# Altium project RNG_RPI.PrjPcb (part 1 of 3)
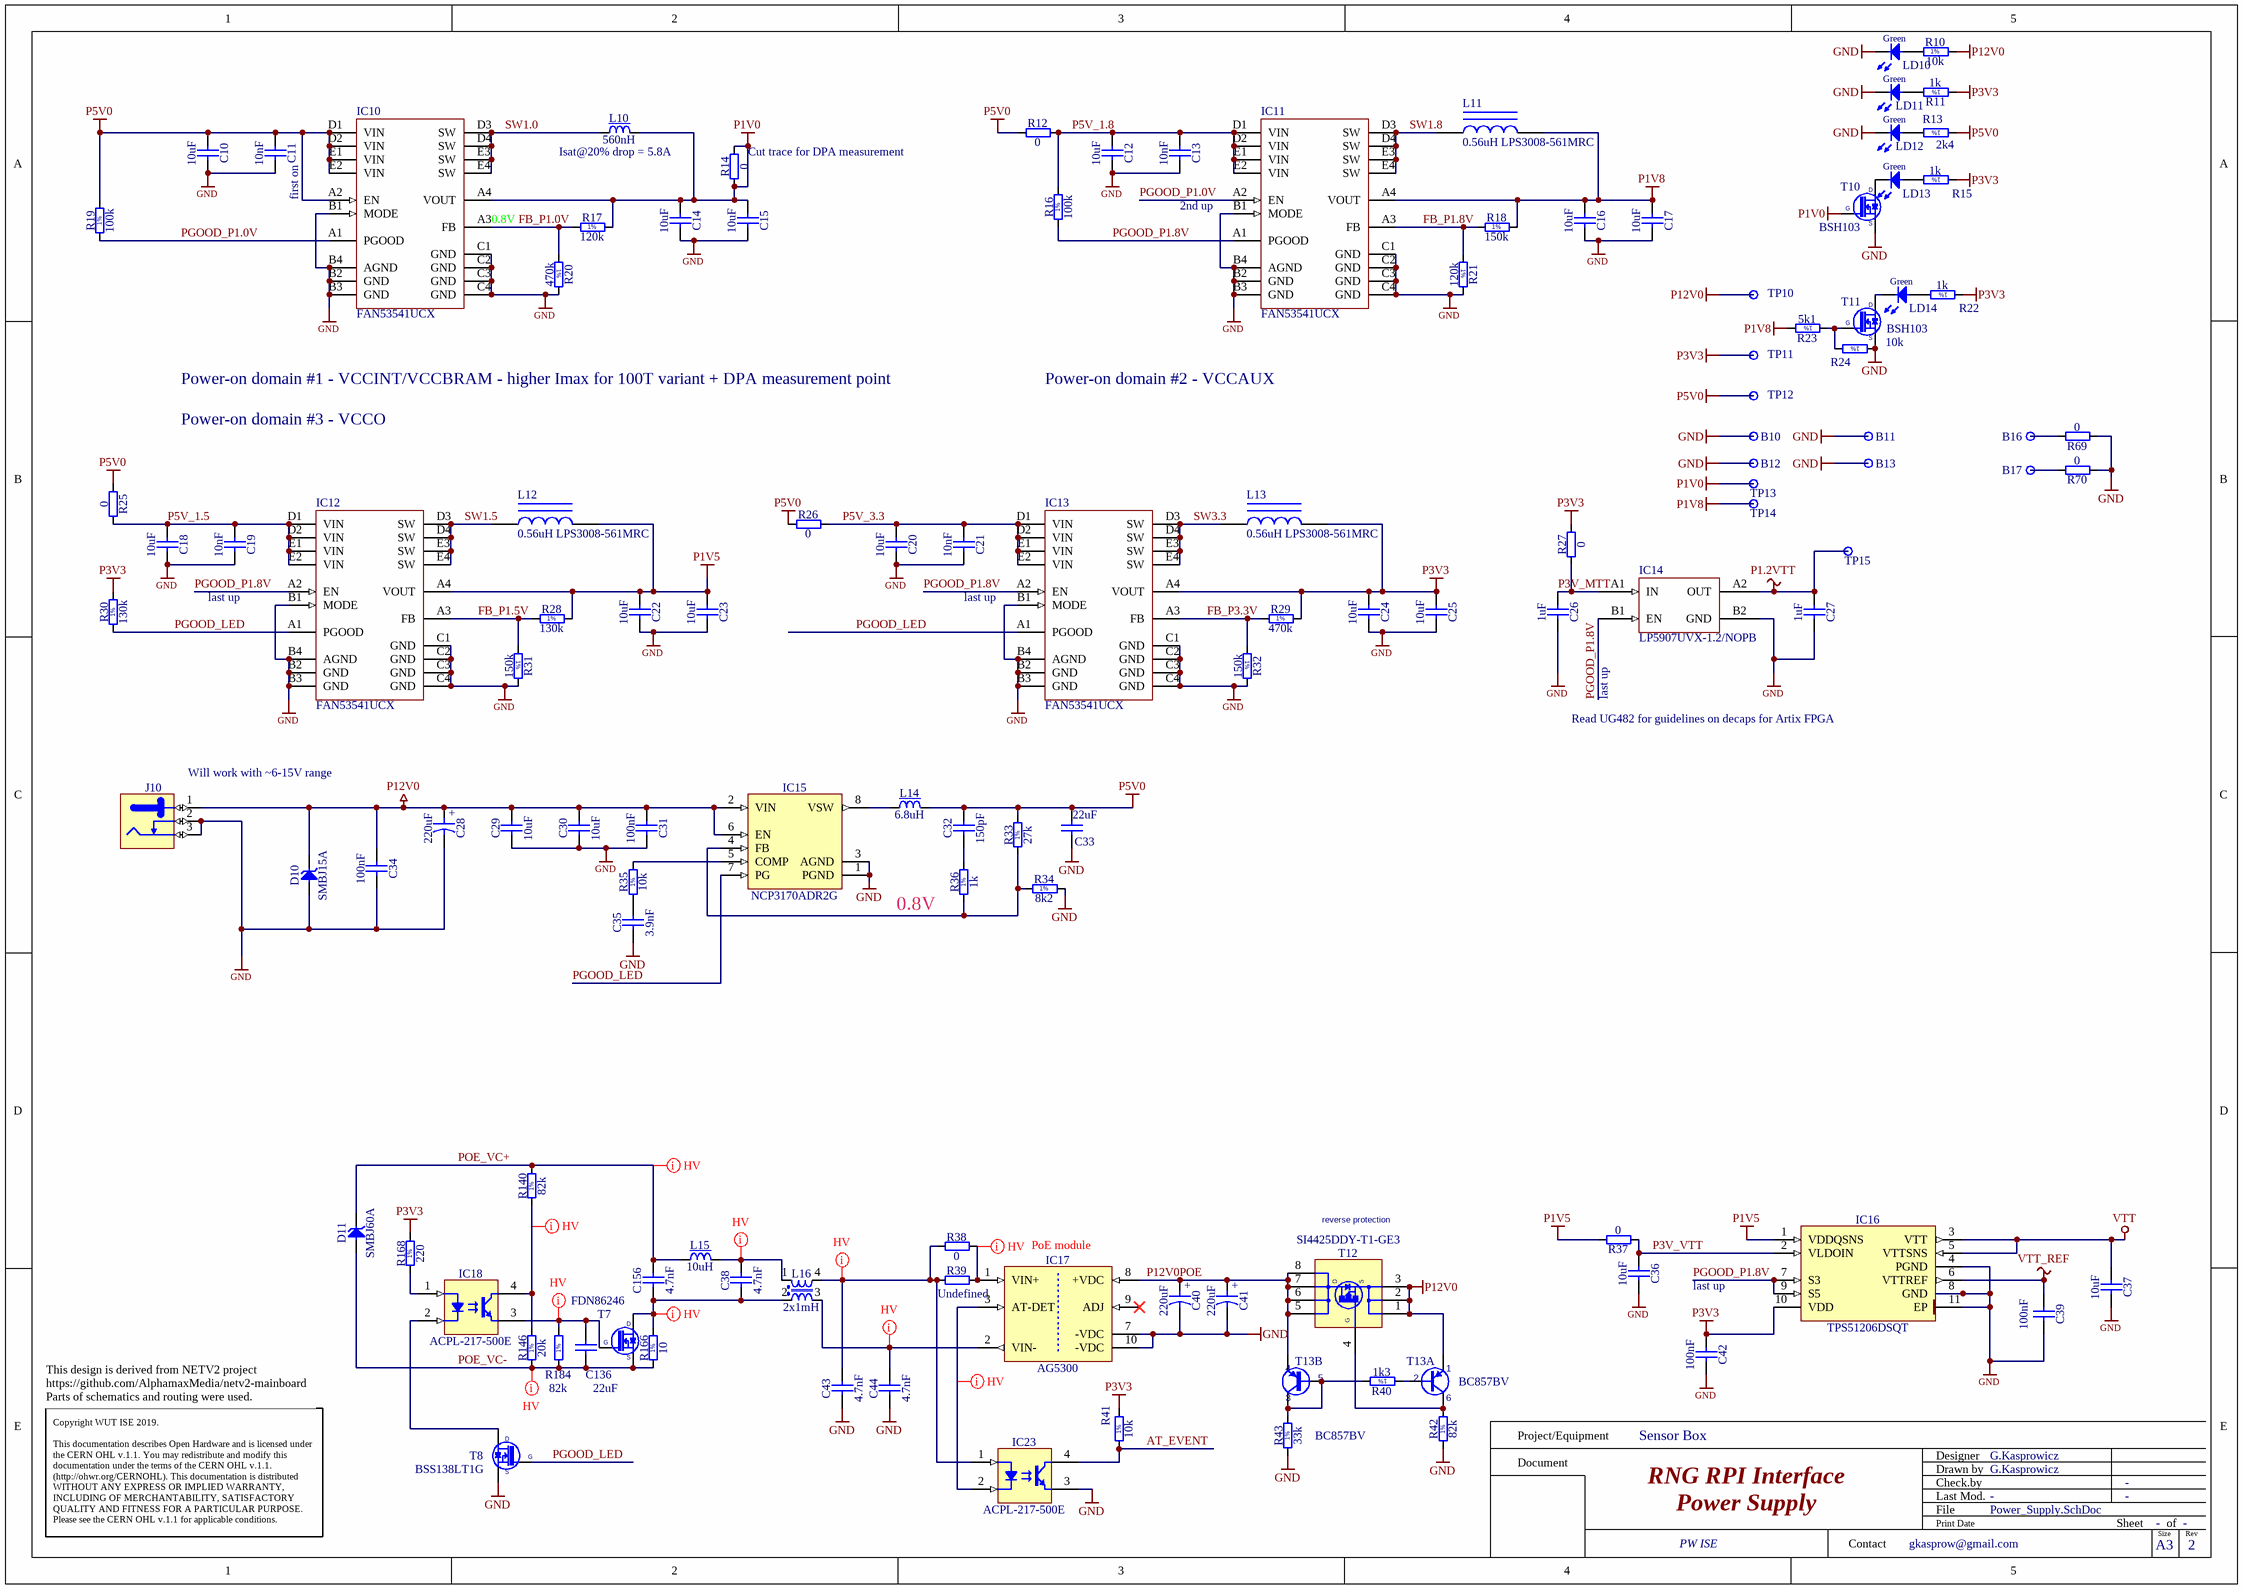
[diagram p0: Power_Supply.SchDoc]
7 sheets, 368 parts. Net scope: global (net labels, ports and power ports of the same name join across sheets).
Board file: RNG_RPI.PCBDOC
Sheets:
  Power_Supply.SchDoc
  FPGA_config.SchDoc
  FPGA.SchDoc
  DDR3_Memory.SchDoc
  GPS_SATA.SchDoc
  Ethernet_SD.SchDoc
  FPGA_Supply.SchDoc

## Sheet Power_Supply.SchDoc: RNG RPI Interface
size 420 x 297 mm; Author: G.Kasprowicz; CompanyName: WUT ISE; DrawnBy: G.Kasprowicz; Organization: WUT ISE; Address1: PW ISE; Address2: Nowowiejska 15/19 00-665 Warsaw; Address3: gkasprow@gmail.com; Revision: 2; SheetNumber: -; SheetTotal: -; ModifiedBy: -; CheckedDate: -; Title2: Power Supply; DivGrp: WUT ISE; Designer: G.Kasprowicz; ModifiedDate: -; ProjectName: Sensor Box

### Parts
B10  Plated Hole  [c130h60]  (value not drawn)  (no BOM)
B11  Plated Hole  [c130h60]  (value not drawn)  (no BOM)
B12  Plated Hole  [c130h60]  (value not drawn)  (no BOM)
B13  Plated Hole  [c130h60]  (value not drawn)  (no BOM)
B16  Plated Hole  [MTG270_500]  (value not drawn)  (no BOM)
B17  Plated Hole  [MTG270_500]  (value not drawn)  (no BOM)
C10  10uF  [CAPC1608X80N]
C11  10nF  [CAPC1005X55N]
C12  10uF  [CAPC1608X80N]
C13  10nF  [CAPC1005X55N]
C14  10uF  [CAPC1608X80N]
C15  10uF  [CAPC1608X80N]
C16  10uF  [CAPC1608X80N]
C17  10uF  [CAPC1608X80N]
C18  10uF  [CAPC1608X80N]
C19  10nF  [CAPC1005X55N]
C20  10uF  [CAPC1608X80N]
C21  10nF  [CAPC1005X55N]
C22  10uF  [CAPC1608X80N]
C23  10uF  [CAPC1608X80N]
C24  10uF  [CAPC1608X80N]
C25  10uF  [CAPC1608X80N]
C26  1uF  [CAPC1005X55N]
C27  1uF  [CAPC1005X55N]
C28  220uF  [CAPAE830X620N]
C29  10uF  [CAPC3216X180N]
C30  10uF  [CAPC3216X180N]
C31  100nF  [CAPC2012X135N]
C32  150pF  [CAPC1608X87N]
C33  22uF  [CAPC2012X135N]
C34  100nF  [CAPC2012X135N]
C35  3.9nF  [CAPC1608X87N]
C36  10uF  [CAPC1608X80N]
C37  10uF  [CAPC1608X80N]
C38  4.7nF  [CAPC3216X140N]
C39  100nF  [CAPC0603X33N]
C40  220uF  [CAPAE830X620N]
C41  220uF  [CAPAE830X620N]
C42  100nF  [CAPC0603X33N]
C43  4.7nF  [CAPC3216X140N]
C44  4.7nF  [CAPC3216X140N]
C136  22uF  [CAPC2012X135N]
C156  4.7nF  [CAPC3216X140N]
D10  SMBJ15A  [DIOM5336X265N]
D11  SMBJ60A  [DIOM5336X265N]
IC10  FAN53541UCX  [BGA20C40P4X5_156X196X62]
IC11  FAN53541UCX  [BGA20C40P4X5_156X196X62]
IC12  FAN53541UCX  [BGA20C40P4X5_156X196X62]
IC13  FAN53541UCX  [BGA20C40P4X5_156X196X62]
IC14  LP5907UVX-1.2/NOPB  [TI_YKE004]
IC15  NCP3170ADR2G  [SOIC127P600X175-8N]
IC16  TPS51206DSQT  [SON40P200X200X80-11N-R100X160]
IC17  AG5300  [SILVERTEL_AG5300]
IC18  ACPL-217-500E  [SOIC127P700X242-4N]
IC23  ACPL-217-500E  [SOIC127P700X242-4N]
J10  Jack  [CLIFF_FC68148(DC-10A)]  (value not drawn)
L10  560nH  [IND_COILCRAFT_XAL5020]
L11  0.56uH LPS3008-561MRC  [COILCRAFT_LPS3008]
L12  0.56uH LPS3008-561MRC  [COILCRAFT_LPS3008]
L13  0.56uH LPS3008-561MRC  [COILCRAFT_LPS3008]
L14  6.8uH  [INDM6965X300N]
L15  10uH  [IND_MURATA-PS_8400]
L16  2x1mH  [IND_WURTH_WE-SL2]
LD10  Green  [LED_KINGBRIGHT_KPH-1608CGCK]
LD11  Green  [LED_KINGBRIGHT_KPH-1608CGCK]
LD12  Green  [LED_KINGBRIGHT_KPH-1608CGCK]
LD13  Green  [LED_KINGBRIGHT_KPH-1608CGCK]
LD14  Green  [LED_KINGBRIGHT_KPH-1608CGCK]
R10  10k  [RESC1005X40N]
R11  1k  [RESC1005X40N]
R12  0  [RESC1608X55N]
R13  2k4  [RESC1005X40N]
R14  0  [RESC1608X55N]
R15  1k  [RESC1005X40N]
R16  100k  [RESC1005X40N]
R17  120k  [RESC1005X40N]
R18  150k  [RESC1005X40N]
R19  100k  [RESC1005X40N]
R20  470k  [RESC1005X40N]
R21  120k  [RESC1005X40N]
R22  1k  [RESC1005X40N]
R23  5k1  [RESC1005X40N]
R24  10k  [RESC1005X40N]
R25  0  [RESC1608X55N]
R26  0  [RESC1608X55N]
R27  0  [RESC1608X55N]
R28  130k  [RESC1005X40N]
R29  470k  [RESC1005X40N]
R30  130k  [RESC1005X40N]
R31  150k  [RESC1005X40N]
R32  150k  [RESC1005X40N]
R33  27k  [RESC1005X40N]
R34  8k2  [RESC1005X40N]
R35  10k  [RESC1005X40N]
R36  1k  [RESC1005X40N]
R37  0  [RESC1608X55N]
R38  0  [RESC1005X40N]
R39  Undefined  [RESC2012X60N]
R40  1k3  [RESC1608X55N]
R41  10k  [RESC1005X40N]
R42  82k  [RESC1608X55N]
R43  33k  [RESC1005X40N]
R69  0  [RESC1608X55N]
R70  0  [RESC1608X55N]
R140  82k  [RESC1608X55N]
R146  20k  [RESC1005X40N]
R166  10  [RESC2012X60N]
R168  220  [RESC1608X55N]
R184  82k  [RESC1608X55N]
T7  FDN86246  [SOT95P237X112-3N]
T8  BSS138LT1G  [SOT95P240X110-3N]
T10  BSH103  [SOT95P230X110-3N]
T11  BSH103  [SOT95P230X110-3N]
T12  SI4425DDY-T1-GE3  [SOIC127P600X175-8N]
T13  BC857BV  [SOTFL50P160X60-6N]  (parts A,B of 2)
TP10  Test Point  [TPS127]  (value not drawn)
TP11  Test Point  [TPS127]  (value not drawn)
TP12  Test Point  [TPS127]  (value not drawn)
TP13  Test Point  [TPS127]  (value not drawn)
TP14  Test Point  [TPS127]  (value not drawn)
TP15  Test Point  [TPS127]  (value not drawn)

### Nets
GND: B10.1 B11.1 B12.1 B13.1 C10.2 C11.2 C12.2 C13.2 C14.2 C15.2 C16.2 C17.2 C18.2 C19.2 C20.2 C21.2 C22.2 C23.2 C24.2 C25.2 C26.2 C27.2 C28.2 C29.1 C30.1 C31.2 C33.1 C34.2 C35.1 C36.2 C37.2 C39.2 C40.2 C41.2 C42.2 C43.1 C44.1 D10.2(A) IC10.B1(MODE) IC10.B2(GND) IC10.B3(GND) IC10.B4(AGND) IC10.C1(GND) IC10.C2(GND) IC10.C3(GND) IC10.C4(GND) IC11.B1(MODE) IC11.B2(GND) IC11.B3(GND) IC11.B4(AGND) IC11.C1(GND) IC11.C2(GND) IC11.C3(GND) IC11.C4(GND) IC12.B1(MODE) IC12.B2(GND) IC12.B3(GND) IC12.B4(AGND) IC12.C1(GND) IC12.C2(GND) IC12.C3(GND) IC12.C4(GND) IC13.B1(MODE) IC13.B2(GND) IC13.B3(GND) IC13.B4(AGND) IC13.C1(GND) IC13.C2(GND) IC13.C3(GND) IC13.C4(GND) IC14.B2(GND) IC15.1(PGND) IC15.3(AGND) IC16.4(PGND) IC16.8(GND) IC16.11(EP) IC17.7(-VDC) IC17.10(-VDC) IC23.3(E) J10.2 J10.3 LD10.1(C) LD11.1(C) LD12.1(C) R20.2 R21.2 R24.1 R31.2 R32.2 R34.2 R42.1 R43.1 R69.1 R70.1 T8.2(S) T10.2(S) T11.2(S)
P1.2VTT: C27.1 IC14.A2(OUT) TP15.1
P1V0: C14.1 C15.1 IC10.A4(VOUT) L10.2 R14.1 R14.2 R17.2 T10.1(G) TP13.1
P1V5: C22.1 C23.1 IC12.A4(VOUT) IC16.1(VDDQSNS) L12.2 R28.2 R37.2
P1V8: C16.1 C17.1 IC11.A4(VOUT) L11.2 R18.2 R23.2 TP14.1
P3V3: C24.1 C25.1 C42.1 IC13.A4(VOUT) IC16.10(VDD) L13.2 R11.1 R15.1 R22.1 R27.2 R29.2 R30.2 R41.2 R168.2 TP11.1
P5V0: C10.1 C11.1 C32.2 C33.2 IC10.A2(EN) IC10.D1(VIN) IC10.D2(VIN) IC10.E1(VIN) IC10.E2(VIN) L14.2 R12.1 R13.1 R19.2 R25.1 R26.1 R33.2 TP12.1
P12V0: C28.1 C29.2 C30.2 C31.1 C34.1 D10.1(C) IC15.2(VIN) IC15.6(EN) J10.1 R10.2 T12.1(S) T12.2(S) T12.3(S) T13.1(E) TP10.1
VTT: C37.1 IC16.3(VTT) IC16.5(VTTSNS)
VTT_REF: C39.1 IC16.6(VTTREF)
AT_EVENT: IC23.4(C) R41.1
FB_P1.0V: IC10.A3(FB) R17.1 R20.1
FB_P1.5V: IC12.A3(FB) R28.1 R31.1
FB_P1.8V: IC11.A3(FB) R18.1 R21.1
FB_P3.3V: IC13.A3(FB) R29.1 R32.1
P3V_MTT: C26.1 IC14.A1(IN) R27.1
P3V_VTT: C36.1 IC16.2(VLDOIN) R37.1
P5V_1.5: C18.1 C19.1 IC12.D1(VIN) IC12.D2(VIN) IC12.E1(VIN) IC12.E2(VIN) R25.2
P5V_1.8: C12.1 C13.1 IC11.D1(VIN) IC11.D2(VIN) IC11.E1(VIN) IC11.E2(VIN) R12.2 R16.2
P5V_3.3: C20.1 C21.1 IC13.D1(VIN) IC13.D2(VIN) IC13.E1(VIN) IC13.E2(VIN) R26.2
P12V0POE: C40.1 C41.1 IC17.8(+VDC) T12.5(D) T12.6(D) T12.7(D) T12.8(D) T13.4(E)
PGOOD_LED: IC12.A1(PGOOD) IC13.A1(PGOOD) IC15.7(PG) R30.1 T8.1(G)
PGOOD_P1.0V: IC10.A1(PGOOD) IC11.A2(EN) R19.1
PGOOD_P1.8V: IC11.A1(PGOOD) IC12.A2(EN) IC13.A2(EN) IC14.B1(EN) IC16.7(S3) IC16.9(S5) R16.1
POE_VC+: C156.2 D11.1(C) L15.1 R140.2
POE_VC-: C136.1 D11.2(A) R146.1 R166.1 R184.1 T7.2(S)
SW1.0: IC10.D3(SW) IC10.D4(SW) IC10.E3(SW) IC10.E4(SW) L10.1
SW1.5: IC12.D3(SW) IC12.D4(SW) IC12.E3(SW) IC12.E4(SW) L12.1
SW1.8: IC11.D3(SW) IC11.D4(SW) IC11.E3(SW) IC11.E4(SW) L11.1
SW3.3: IC13.D3(SW) IC13.D4(SW) IC13.E3(SW) IC13.E4(SW) L13.1
NetB16_1: B16.1 R69.2
NetB17_1: B17.1 R70.2
NetC32_1: C32.1 R36.2
NetC35_2: C35.2 R35.1
NetC38_1: C38.1 C156.1 L16.2 R166.2 T7.3(D)
NetC38_2: C38.2 L15.2 L16.1
NetC43_2: C43.2 IC23.1(A) L16.4 R38.1 R39.1
NetC44_2: C44.2 IC17.2(VIN-) L16.3
NetC136_2: C136.2 IC18.3(E) R184.2 T7.1(G)
NetIC15_4: IC15.4(FB) R33.1 R34.1 R36.1
NetIC15_5: IC15.5(COMP) R35.2
NetIC15_8: IC15.8(VSW) L14.1
NetIC17_1: IC17.1(VIN+) R38.2 R39.2
NetIC17_3: IC17.3(AT-DET) IC23.2(C)
NetIC18_1: IC18.1(A) R168.1
NetIC18_2: IC18.2(C) T8.3(D)
NetIC18_4: IC18.4(C) R140.1 R146.2
NetLD10_2: LD10.2(A) R10.1
NetLD11_2: LD11.2(A) R11.2
NetLD12_2: LD12.2(A) R13.2
NetLD13_1: LD13.1(C) T10.3(D)
NetLD13_2: LD13.2(A) R15.2
NetLD14_1: LD14.1(C) T11.3(D)
NetLD14_2: LD14.2(A) R22.2
NetR23_1: R23.1 R24.2 T11.1(G)
NetR40_1: R40.1 T13.2(B)
NetR40_2: R40.2 R43.2 T13.3(C) T13.5(B)
NetR42_2: R42.2 T12.4(S) T13.6(C)

Not connected (* = marked no-connect by the designer): IC17 9(ADJ)*

### Layout directives
net class HV: NetC38_1, NetC38_2, NetC43_2, NetC44_2, NetC136_2, NetIC17_1, NetIC17_3, NetIC18_4, POE_VC+, POE_VC-

### Notes on the sheet
- (near L10) Isat@20% drop = 5.8A
- (near R14) Cut trace for DPA measurement
- (near C11) first on
- (near IC10) 0.8V
- 2nd up
- Power-on domain #1 - VCCINT/VCCBRAM - higher Imax for 100T variant + DPA measurement point
- Power-on domain #2 - VCCAUX
- Power-on domain #3 - VCCO
- last up
- Read UG482 for guidelines on decaps for Artix FPGA
- (near J10) Will work with ~6-15V range
- (near R36) 0.8V
- (near IC17) PoE module
- (near T12) reverse protection
- This design is derived from NETV2 project
  https://github.com/AlphamaxMedia/netv2-mainboard
  Parts of schematics and routing were used.
- Project/Equipment
- Document
- Designer
- Drawn by
- Check.by
- Copyright WUT ISE 2019.
  This documentation describes Open Hardware and is licensed under the CERN OHL v.1.1. You may redistribute and modify this documentation under the terms of the CERN OHL v.1.1. (http://ohwr.org/CERNOHL). This documentation is distributed WITHOUT ANY EXPRESS OR IMPLIED WARRANTY, INCLUDING OF MERCHANTABILITY, SATISFACTORY QUALITY AND FITNESS FOR A PARTICULAR PURPOSE. Please see the CERN OHL v.1.1 for applicable conditions.
- Contact
- File
- Last Mod.
- Print Date
- Sheet
- Size
- A3
- of
- Rev
- (in symbol CAE830-620_220UF_16V_20%) +
- (in symbol R0402_1K_1%_0.0625W_100PPM) 1%
- (in symbol R0402_2K4_1%_0.0625W_100PPM) 1%
- (in symbol R0402_5K1_1%_0.0625W_100PPM) 1%
- (in symbol R0402_8K2_1%_0.0625W_100PPM) 1%
- (in symbol R0402_10K_1%_0.0625W_100PPM) 1%
- (in symbol R0402_20K_1%_0.0625W_100PPM) 1%
- (in symbol R0402_27K_1%_0.0625W_100PPM) 1%
- (in symbol R0402_33K_1%_0.0625W_100PPM) 1%
- (in symbol R0402_100K_1%_0.0625W_100PPM) 1%
- (in symbol R0402_120K_1%_0.0625W_100PPM) 1%
- (in symbol R0402_130K_1%_0.0625W_100PPM) 1%
- (in symbol R0402_150K_1%_0.0625W_100PPM) 1%
- (in symbol R0402_470K_1%_0.0625W_100PPM) 1%
- (in symbol R0603_1K3_1%_0.1W_100PPM) 1%
- (in symbol R0603_82K_1%_0.1W_100PPM) 1%
- (in symbol R0603_220R_1%_0.1W_100PPM) 1%
- (in symbol R0805_10R_1%_0.125W_200PPM) 1%
- (in symbol SI4425DDY-T1-GE3) G

### Library data of the parts
B10-B13 = PLATED_HOLE0.6_PAD1.3: Single Terminal Socket; Part Description: Plated Through Hole: Hole Dia.=0.6mm Pad Dia.=1.3mm; Mounted: No; Part Number: PLATED_HOLE0.6_PAD1.3; Component Type: Standard (No BOM); Pin Count: 1; Family: Plated Hole; Socket: No; SMD: No; Sense: No; Status: None; ComponentHeight: 0mm; HelpURL: Undefined; Author: CERN DEM MR; CreateDate: 02.03.2016; LatestRevisionDate: 02.03.2016; PackageDescription: Plated Through Hole: Hole Dia.=0.6mm Pad Dia.=1.3mm
B16 B17 = PLATED_HOLE2.7_PAD5.0: Single Terminal Socket; Part Description: Plated Through Hole: Hole Dia.=2.7mm Pad Dia.=5.0mm; Mounted: No; Part Number: PLATED_HOLE2.7_PAD5.0; Component Type: Standard (No BOM); Pin Count: 1; Family: Plated Hole; Socket: No; SMD: No; Sense: No; Status: None; ComponentHeight: 0mm; HelpURL: Undefined; Author: CERN DEM JMW; CreateDate: 27.09.2011; LatestRevisionDate: 27.09.2011; PackageDescription: Plated Through Hole: Hole Dia.=2.7mm Pad Dia.=5.0mm
C10 C12 C14-C18 C20 C22-C25 C36 C37 = CC0603_10UF_10V_10%_X5R: Non-polarised capacitor; Part Description: SMD Multilayer Chip Ceramic Capacitor; Manufacturer: GENERIC; Manufacturer1 Part Number: GRM188R61A106KE69D; Voltage: 10V; TC: X5R; Tolerance: ±10%; Part Number: CC0603_10UF_10V_10%_X5R; Component Kind: Standard; Component Type: Standard; Pin Count: 2; Value: 10uF; Status: None; Manufacturer Part Number: CC0603_10UF_10V_10%_X5R; Case: 0603; Mounted: Yes; Socket: No; SMD: Yes; Sense: No; Manufacturer1 Example: MURATA; Manufacturer1 ComponentHeight: 0.8mm; HelpURL: \\cern.ch\dfs\Applications\Altium\Datasheets\CC0603_MURATA_GRM188R61A106KE69D.pdf; Author: CERN DEM JLC; CreateDate: 31.01.2017; LatestRevisionDate: 31.01.2017
C11 C13 C19 C21 = CC0402_10NF_16V_10%_X7R: Non-polarised capacitor; Part Description: SMD Multilayer Chip Ceramic Capacitor; Manufacturer: GENERIC; Manufacturer1 Part Number: 223878715636; Voltage: 16V; TC: X7R; Tolerance: ±10%; Part Number: CC0402_10NF_16V_10%_X7R; Component Kind: Standard; Component Type: Standard; Pin Count: 2; Value: 10nF; Status: Not Recommended; Manufacturer Part Number: CC0402_10NF_16V_10%_X7R; Case: 0402; Mounted: Yes; Socket: No; SMD: Yes; Sense: No; Manufacturer1 Example: PHYCOMP; Manufacturer1 ComponentHeight: 0.55mm; HelpURL: \\cern.ch\dfs\Applications\Altium\Datasheets\CC0402_X7R_PHYCOMP.pdf; Author: CERN DEM JLC; CreateDate: 03.12.2007; LatestRevisionDate: 03.12.2007
C26 C27 = CC0402_1UF_16V_10%_X5R: Non-polarised capacitor; Part Description: SMD Multilayer Chip Ceramic Capacitor; Manufacturer: GENERIC; Manufacturer1 Part Number: C1005X5R1C105KT; Voltage: 16V; TC: X5R; Tolerance: ±10%; Part Number: CC0402_1UF_16V_10%_X5R; Component Kind: Standard; Component Type: Standard; Pin Count: 2; Value: 1uF; Status: Preferred; Manufacturer Part Number: CC0402_1UF_16V_10%_X5R; Case: 0402; Mounted: Yes; Socket: No; SMD: Yes; Sense: No; Manufacturer1 Example: TDK; Manufacturer1 ComponentHeight: 0.55mm; HelpURL: \\cern.ch\dfs\Applications\Altium\Datasheets\CC0402_X5R_TDK_C.pdf; Author: CERN DEM JLC; CreateDate: 25.10.2012; LatestRevisionDate: 25.10.2012
C28 C40 C41 = CAE830-620_220UF_16V_20%: Polarised capacitor; Part Description: Aluminum Electrolytic SMT Capacitor; Manufacturer: PANASONIC; Manufacturer Part Number: EEEFK1C221AP; Voltage: 16V; Tolerance: ±20%; Part Number: CAE830-620_220UF_16V_20%; Component Kind: Standard; Component Type: Standard; Pin Count: 2; Value: 220uF; Status: Not Recommended; Case: E; Mounted: Yes; Socket: No; SMD: Yes; Sense: No; ComponentHeight: 6.2mm; HelpURL: \\cern.ch\dfs\Applications\Altium\Datasheets\CAE_PANASONIC_FK.pdf; Author: CERN DEM JLC; CreateDate: 03.12.2007; LatestRevisionDate: 05.11.2014
C29 C30 = CC1206_10UF_25V_10%_X7R: Non-polarised capacitor; Part Description: SMD Multilayer Chip Ceramic Capacitor; Manufacturer: GENERIC; Manufacturer1 Part Number: C1206C106K4RACTU; Voltage: 25V; TC: X7R; Tolerance: ±10%; Part Number: CC1206_10UF_25V_10%_X7R; Component Kind: Standard; Component Type: Standard; Pin Count: 2; Value: 10uF; Status: Preferred; Manufacturer Part Number: CC1206_10uF_25V_10%_X7R; Case: 1206; Mounted: Yes; Socket: No; SMD: Yes; Sense: No; Manufacturer1 Example: KEMET; Manufacturer1 ComponentHeight: 1.8mm; HelpURL: \\cern.ch\dfs\Applications\Altium\Datasheets\CC1206_X7R_KEMET.pdf; Author: CERN DEM JLC; CreateDate: 12.09.2012; LatestRevisionDate: 12.09.2012
C31 C34 = CC0805_100NF_50V_10%_X7R: Non-polarised capacitor; Part Description: SMD Multilayer Chip Ceramic Capacitor; Manufacturer: GENERIC; Manufacturer1 Part Number: C2012X7R1H104K085AA; Voltage: 50V; TC: X7R; Tolerance: ±10%; Part Number: CC0805_100NF_50V_10%_X7R; Component Kind: Standard; Component Type: Standard; Pin Count: 2; Value: 100nF; Status: Preferred; Manufacturer Part Number: CC0805_100NF_50V_10%_X7R; Case: 0805; Mounted: Yes; Socket: No; SMD: Yes; Sense: No; Manufacturer1 Example: TDK; Manufacturer1 ComponentHeight: 1mm; HelpURL: \\cern.ch\dfs\Applications\Altium\Datasheets\CC0805_X7R_TDK_C.pdf; Author: CERN DEM JLC; CreateDate: 03.12.2007; LatestRevisionDate: 22.04.2015
C32 = CC0603_150PF_50V_1%_NP0: Non-polarised capacitor; Part Description: SMD Multilayer Chip Ceramic Capacitor; Manufacturer: GENERIC; Manufacturer1 Part Number: CC0603FRNPO9BN151; Voltage: 50V; TC: C0G/NP0; Tolerance: ±1%; Part Number: CC0603_150PF_50V_1%_NP0; Component Kind: Standard; Component Type: Standard; Pin Count: 2; Value: 150pF; Status: None; Manufacturer Part Number: CC0603_150PF_50V_1%_NP0; Case: 0603; Mounted: Yes; Socket: No; SMD: Yes; Sense: No; Manufacturer1 Example: PHYCOMP; Manufacturer1 ComponentHeight: 0.7mm; HelpURL: \\cern.ch\dfs\Applications\Altium\Datasheets\CC0805_NP0_PHYCOMP_16VTO50V.pdf; Author: CERN DEM MR; CreateDate: 17.02.2016; LatestRevisionDate: 17.02.2016
C33 C136 = CC0805_22UF_16V_10%_X5R: Non-polarised capacitor; Part Description: SMD Multilayer Chip Ceramic Capacitor; Manufacturer: GENERIC; Manufacturer1 Part Number: C2012X5R1C226KT; Voltage: 16V; TC: X5R; Tolerance: ±10%; Part Number: CC0805_22UF_16V_10%_X5R; Component Kind: Standard; Component Type: Standard; Pin Count: 2; Value: 22uF; Status: Preferred; Manufacturer Part Number: CC0805_22UF_16V_10%_X5R; Case: 0805; Mounted: Yes; Socket: No; SMD: Yes; Sense: No; Manufacturer1 Example: TDK; Manufacturer1 ComponentHeight: 1.35mm; HelpURL: \\cern.ch\dfs\Applications\Altium\Datasheets\CC0805_X5R_TDK_C.pdf; Author: CERN DEM JLC; CreateDate: 25.10.2012; LatestRevisionDate: 25.10.2012
C35 = CC0603_3.9NF_50V_5%_X7R: Non-polarised capacitor; Part Description: SMD Multilayer Chip Ceramic Capacitor; Manufacturer: GENERIC; Manufacturer1 Part Number: 223858615631; Voltage: 50V; TC: X7R; Tolerance: ±5%; Part Number: CC0603_3.9NF_50V_5%_X7R; Component Kind: Standard; Component Type: Standard; Pin Count: 2; Value: 3.9nF; Status: Preferred; Manufacturer Part Number: CC0603_3.9NF_50V_5%_X7R; Case: 0603; Mounted: Yes; Socket: No; SMD: Yes; Sense: No; Manufacturer1 Example: PHYCOMP; Manufacturer1 ComponentHeight: 0.87mm; HelpURL: \\cern.ch\dfs\Applications\Altium\Datasheets\CC0603_X7R_PHYCOMP.pdf; Author: CERN DEM JLC; CreateDate: 03.12.2007; LatestRevisionDate: 03.12.2007
C38 C43 C44 C156 = CAP_SMD_1206_4.7n_500V: Non-polarised capacitor; Part Number: CC1206_4.7NF_500V_10%_X7R; Part Description: SMD Multilayer Chip Ceramic Capacitor; Manufacturer: GENERIC; Manufacturer1 Part Number: C1206C472KCRACTU; Voltage: 500V; TC: X7R; Tolerance: ±10%; Table: Capacitors SMD; Component Kind: Standard; Component Type: Standard; Pin Count: 2; Value: 4.7nF; Status: Preferred; Manufacturer Part Number: CC1206_4.7NF_500V_10%_X7R; Case: 1206; Mounted: Yes; Socket: No; SMD: Yes; Manufacturer1 Example: KEMET; Manufacturer1 ComponentHeight: 1.7mm; HelpURL: \\cern.ch\dfs\Applications\Altium\Datasheets\CC1206_X7R_VISHAY_VJ.pdf; Author: GK; CreateDate: 2007-12-03; LatestRevisionDate: 2007-12-03
C39 C42 = CC0201_100NF_6.3V_10%_X5R: Non-polarised capacitor; Part Description: SMD Multilayer Chip Ceramic Capacitor; Manufacturer: GENERIC; Manufacturer1 Part Number: 02016D104KAT2A; Voltage: 6.3V; TC: X5R; Tolerance: ±10%; Part Number: CC0201_100NF_6.3V_10%_X5R; Component Kind: Standard; Component Type: Standard; Pin Count: 2; Value: 100nF; Status: Not Recommended; Manufacturer Part Number: CC0201_100NF_6.3V_10%_X5R; Case: 0201; Mounted: Yes; Socket: No; SMD: Yes; Sense: No; Manufacturer1 Example: AVX; Manufacturer1 ComponentHeight: 0.33mm; HelpURL: \\cern.ch\dfs\Applications\Altium\Datasheets\CC0201_X5R_AVX.pdf; Author: CERN DEM JLC; CreateDate: 03.12.2007; LatestRevisionDate: 03.12.2007
D10 = SMBJ15A: Zener Diode; Part Description: Uni-Directional Transient Voltage Suppressor Diode; Manufacturer: FAIRCHILD SEMICONDUCTOR; Voltage: 15V; Power: 600W; PressFit: No; Bonding: No; Part Number: SMBJ15A; Component Kind: Standard; Component Type: Standard; Device: SMBJ15A; PackageDescription: DO-214-AA/SMB Diode, Molded Body; 5.34mm L X 3.625mm W X 2.65mm H, IPC Medium Density; Manufacturer Part Number: SMBJ15A; Pin Count: 2; Case: DO-214AA; Mounted: Yes; Socket: No; SMD: Yes; Sense: No; ComponentHeight: 2.65mm; HelpURL: \\cern.ch\dfs\Applications\Altium\Datasheets\SMBJ.pdf; Author: CERN DEM JLC; CreateDate: 08.12.2008; LatestRevisionDate: 19.12.2011
D11 = SMBJ60A: Zener Diode; Part Description: Uni-Directional Transient Voltage Suppressor Diode; Manufacturer: FAIRCHILD SEMICONDUCTOR; Voltage: 60V; Power: 600W; PressFit: No; Bonding: No; Part Number: SMBJ60A; Component Kind: Standard; Component Type: Standard; Device: SMBJ60A; PackageDescription: DO-214-AA/SMB Diode, Molded Body; 5.34mm L X 3.625mm W X 2.65mm H, IPC Medium Density; Manufacturer Part Number: SMBJ60A; Pin Count: 2; Case: DO-214AA; Mounted: Yes; Socket: No; SMD: Yes; Sense: No; ComponentHeight: 2.65mm; HelpURL: \\cern.ch\dfs\Applications\Altium\Datasheets\SMBJ.pdf; Author: CERN DEM JLC; CreateDate: 30.06.2008; LatestRevisionDate: 19.12.2011
IC10-IC13 = FAN53541UCX: 2.4MHz, 5A TinyBuck Synchronous Buck Regulator; MYPN: UFAN53541UCX; VENDOR: Fairchild Semiconductor; MPN: FAN53541UCX
IC14 = LP5907UVX: Ultra low-noise 250mA LDO for RF and analog in DSBGA; VENDOR: TI; MYPN: ULP5907UVX-1.2; MPN: LP5907UVX-1.2/NOPB
IC15 = NCP3170ADR2G: Synchronous PWM Switching Converter; Manufacturer: ON SEMICONDUCTOR; PressFit: No; Bonding: No; Part Number: NCP3170ADR2G; Component Kind: Standard; Component Type: Standard; Device: NCP3170ADR2G; PackageDescription: SOIC 8, Pitch 1.27mm - Body 4x5mm, IPC Medium Density; Part Description: Synchronous PWM Switching Converter; Manufacturer Part Number: NCP3170ADR2G; Pin Count: 8; Case: SOIC8; Mounted: Yes; Socket: No; SMD: Yes; Sense: No; ComponentHeight: 1.75mm; Author: CERN DEM MR; HelpURL: \\cern.ch\dfs\Applications\Altium\Datasheets\NCP3170ADR2G.pdf; CreateDate: 30.05.2016; LatestRevisionDate: 30.05.2016
IC16 = TPS51206DSQT: 2-A Peak Sink / Source DDR Termination Regulator With VTTREF Buffered Reference for DDR2, DDR3 and DDR3L; Part Description: 2A Peak Sink / Source DDR Termination Regulator With VTTREF Buffered Reference for DDR2, DDR3 and DDR3L; Manufacturer: TEXAS INSTRUMENTS; PressFit: No; Bonding: No; Part Number: TPS51206DSQT; Component Kind: Standard; Component Type: Standard; Device: TPS51206DSQT; PackageDescription: SON, 0.40mm Pitch; 10 Pin, 2.00mm W X 2.00mm L X 0.80mm H Body, (w/thermal tab 1.00 X 1.60 mm), IPC Medium Density; Status: Not Recommended; Manufacturer Part Number: TPS51206DSQT; Pin Count: 11; Case: SON10; Mounted: Yes; Socket: No; SMD: Yes; Sense: No; ComponentHeight: 0.8mm; HelpURL: \\cern.ch\dfs\Applications\Altium\Datasheets\TPS51206DSQT.pdf; Author: CERN DEM JLC; CreateDate: 22.01.2015; LatestRevisionDate: 30.03.2017
IC17 = AG5300: Power-over-Ethernet Plus (POE+) Module; Part Description: 12V 30W Power-over-Ethernet Plus (POE+); Manufacturer: SILVERTEL; PressFit: No; Bonding: No; Part Number: AG5300; Component Kind: Standard; Component Type: Standard; Device: AG5300; PackageDescription: Power-over-Ethernet Plus (POE+) Module, Body L 57.3mm x W 18mm x H 14mm; Manufacturer Part Number: AG5300; Pin Count: 10; Mounted: Yes; Socket: No; SMD: No; Sense: No; ComponentHeight: 14mm; HelpURL: \\cern.ch\dfs\Applications\Altium\Datasheets\AG5300.pdf; Author: CERN DEM JLC; CreateDate: 20.03.2018; LatestRevisionDate: 20.03.2018
IC18 IC23 = ACPL-217-500E: Single Optocoupler; Part Description: DC Input, Half-Pitch Phototransistor Optocoupler; Manufacturer: AVAGO TECHNOLOGIES; PressFit: No; Bonding: No; Part Number: ACPL-217-500E; Component Kind: Standard; Component Type: Standard; Device: ACPL-217-500E; PackageDescription: SOIC, 1.27mm, pitch; 4 pin, 2.60mm W X 4.40mm L X 2.42mm H body, IPC Medium Density; Status: Not Recommended; Manufacturer Part Number: ACPL-217-500E; Pin Count: 4; Case: SOIC4; Mounted: Yes; Socket: No; SMD: Yes; Sense: No; ComponentHeight: 2.42mm; HelpURL: \\cern.ch\dfs\Applications\Altium\Datasheets\ACPL-217-500E.pdf; Author: CERN DEM JLC; CreateDate: 11.11.2014; LatestRevisionDate: 11.11.2014
J10 = CLIFF_FC68148(DC-10A): 12V /  5A, 2.1mm Diameter Pin, DC Power Socket With  Switch. DC10A Type; Part Description: 12V/5A, 2.1mm Diameter Pin, DC Power Socket With  Switch (DC10A Type); Manufacturer: CLIFF ELECTRONIC COMPONENTS; PressFit: No; Part Number: CLIFF_FC68148(DC-10A); Component Kind: Standard; Component Type: Standard; Pin Count: 3; Family: Jack; Mounted: Yes; Socket: No; SMD: No; Sense: No; Status: None; Manufacturer Part Number: FC68148 (DC-10A); ComponentHeight: 11mm; HelpURL: \\cern.ch\dfs\Applications\Altium\Datasheets\CLIFF_FC68148(DC-10A).pdf; Author: CERN DEM JLC; CreateDate: 23.11.2010; LatestRevisionDate: 23.11.2010
L10 = IND_560NH_20%_COILCRAFT_XAL5020: Inductor With Core; Part Description: SMD Shielded Power Inductor; Manufacturer Part Number: XAL5020-561MEB; Power: 9.9A; Resistance: 0.00954R; Tolerance: ±20%; Part Number: IND_560NH_20%_COILCRAFT_XAL5020; Component Kind: Standard; Component Type: Standard; Pin Count: 2; Value: 560nH; Status: None; Manufacturer: COILCRAFT; Mounted: Yes; Socket: No; SMD: Yes; Sense: No; ComponentHeight: 2mm; HelpURL: \\cern.ch\dfs\Applications\Altium\Datasheets\IND_COILCRAFT_XAL5020.pdf; Author: CERN DEM MR; CreateDate: 14.03.2016; LatestRevisionDate: 14.03.2016
L11-L13 = Inductor Iron: Magnetic-Core Inductor; VENDOR: COILCRAFT; MYPN: L-LPS3008-561MR; MPN: LPS3008-561MRC
L14 = IND2525_6.8UH_20%_VISHAY_IHLP-2525CZ-01: Inductor With Core; Part Description: Low Profile, High Current IHLP® Inductor; Manufacturer: VISHAY DALE; Manufacturer Part Number: IHLP2525CZER6R8M01; Power: 4.5A; Resistance: 0.054R; Tolerance: ±20%; Part Number: IND2525_6.8UH_20%_VISHAY_IHLP-2525CZ-01; Component Kind: Standard; Component Type: Standard; Pin Count: 2; Value: 6.8uH; Status: None; Case: 2525; Mounted: Yes; Socket: No; SMD: Yes; Sense: No; ComponentHeight: 3mm; HelpURL: \\cern.ch\dfs\Applications\Altium\Datasheets\IND2525_VISHAY_IHLP-2525CZ-01.pdf; Author: CERN DEM MR; CreateDate: 29.06.2017; LatestRevisionDate: 29.06.2017
L15 = IND_10UH_10%_MURATA-PS_8400: Inductor With Core; Part Description: Miniature Surface Mount Power Inductor (8400 Serie); Manufacturer: MURATA POWER SOLUTIONS; Manufacturer Part Number: 84103C; Power: 950mA; Resistance: 0.24R; Tolerance: ±10%; Part Number: IND_10UH_10%_MURATA-PS_8400; Component Kind: Standard; Component Type: Standard; Pin Count: 2; Value: 10uH; Status: None; Mounted: Yes; Socket: No; SMD: Yes; Sense: No; ComponentHeight: 2.9mm; HelpURL: \\cern.ch\dfs\Applications\Altium\Datasheets\IND_MURATA-PS_8400.pdf; Author: CERN DEM JLC; CreateDate: 02.07.2012; LatestRevisionDate: 02.07.2012
L16 = IND_1MH_50%_WURTH_WE-SL2-744222: Inductor Common Mode; Part Description: Common Mode SMD Line Filter (WE-SL2 Series); Manufacturer: WURTH ELEKTRONIK; Manufacturer Part Number: 744222; Power: 800mA; Resistance: 0.31R; Tolerance: ±50%; Part Number: IND_1MH_50%_WURTH_WE-SL2-744222; Component Kind: Standard; Component Type: Standard; Pin Count: 4; Value: 2x1mH; Status: None; Mounted: Yes; Socket: No; SMD: Yes; Sense: No; ComponentHeight: 5.3mm; HelpURL: \\cern.ch\dfs\Applications\Altium\Datasheets\IND_WURTH_WE-SL2_744222.pdf; Author: CERN DEM JLC; CreateDate: 04.06.2012; LatestRevisionDate: 15.10.2012
LD10-LD14 = LED_KINGBRIGHT_KPH-1608CGCK: LED Green 1C 2A; Part Description: SMD Green LED, Case 1.6mmX0.8mm(0603), 0.65mm Thickness; PressFit: No; Bonding: No; Part Number: LED_KINGBRIGHT_KPH-1608CGCK; Component Kind: Standard; Component Type: Standard; Color: Green; PackageDescription: SMT Green LED, Case 0603, Body L 1.6 x W 0.8mm H 0.65mm; Manufacturer: KINGBRIGHT; Manufacturer Part Number: KPH-1608CGCK; Pin Count: 2; Mounted: Yes; Socket: No; SMD: Yes; Sense: No; ComponentHeight: 0.65mm; HelpURL: \\cern.ch\dfs\Applications\Altium\Datasheets\LED_KINGBRIGHT_KPH-1608CGCK.pdf; Author: CERN DEM JLC; CreateDate: 03/07/2017; LatestRevisionDate: 03/07/2017
R10 R24 R35 R41 = R0402_10K_1%_0.0625W_100PPM: Resistor - 1%; Part Description: General Purpose Thick Film Chip Resistor; Manufacturer: GENERIC; Manufacturer1 Part Number: 232270671003L; TC: ±100ppm/°C; PressFit: No; Part Number: R0402_10K_1%_0.0625W_100PPM; Component Kind: Standard; Component Type: Standard; Pin Count: 2; Value: 10k; Status: Not Recommended; Power: 0.0625W; Tolerance: ±1%; Manufacturer Part Number: R0402_10K_1%_0.0625W_100PPM; Case: 0402; Mounted: Yes; Sense: No; Socket: No; SMD: Yes; Manufacturer1 Example: YAGEO PHYCOMP; Manufacturer1 ComponentHeight: 0.4mm; HelpURL: \\cern.ch\dfs\Applications\Altium\Datasheets\R0402_Phycomp_RC0402.pdf; Author: CERN DEM JLC; CreateDate: 03.12.2007; LatestRevisionDate: 17.10.2012
R11 R15 R22 R36 = R0402_1K_1%_0.0625W_100PPM: Resistor - 1%; Part Description: General Purpose Thick Film Chip Resistor; Manufacturer: GENERIC; Manufacturer1 Part Number: 232270671002L; TC: ±100ppm/°C; PressFit: No; Part Number: R0402_1K_1%_0.0625W_100PPM; Component Kind: Standard; Component Type: Standard; Pin Count: 2; Value: 1k; Status: Not Recommended; Power: 0.0625W; Tolerance: ±1%; Manufacturer Part Number: R0402_1K_1%_0.0625W_100PPM; Case: 0402; Mounted: Yes; Sense: No; Socket: No; SMD: Yes; Manufacturer1 Example: YAGEO PHYCOMP; Manufacturer1 ComponentHeight: 0.4mm; HelpURL: \\cern.ch\dfs\Applications\Altium\Datasheets\R0402_Phycomp_RC0402.pdf; Author: CERN DEM JLC; CreateDate: 03.12.2007; LatestRevisionDate: 17.10.2012
R12 R14 R25-R27 R37 R69 R70 = R0603_0R_JUMPER: Resistor; Part Description: 1A (0.05R Max DC Resistance) Zero Ohm Jumper; Manufacturer: GENERIC; Manufacturer1 Part Number: NRC06Z0; PressFit: No; Part Number: R0603_0R_JUMPER; Component Kind: Standard; Component Type: Standard; Pin Count: 2; Value: 0; Status: Preferred; Manufacturer Part Number: R0603_0R_JUMPER; Case: 0603; Mounted: Yes; Sense: No; Socket: No; SMD: Yes; Manufacturer1 Example: NIC COMPONENT; Manufacturer1 ComponentHeight: 0.55mm; HelpURL: \\cern.ch\dfs\Applications\Altium\Datasheets\R0603_NIC_NRC.pdf; Author: CERN DEM JLC; CreateDate: 03.12.2007; LatestRevisionDate: 13.03.2008
R13 = R0402_2K4_1%_0.0625W_100PPM: Resistor - 1%; Part Description: General Purpose Thick Film Chip Resistor; Manufacturer: GENERIC; Manufacturer1 Part Number: 232270672402L; TC: ±100ppm/°C; PressFit: No; Part Number: R0402_2K4_1%_0.0625W_100PPM; Component Kind: Standard; Component Type: Standard; Pin Count: 2; Value: 2k4; Status: Not Recommended; Power: 0.0625W; Tolerance: ±1%; Manufacturer Part Number: R0402_2K4_1%_0.0625W_100PPM; Case: 0402; Mounted: Yes; Sense: No; Socket: No; SMD: Yes; Manufacturer1 Example: YAGEO PHYCOMP; Manufacturer1 ComponentHeight: 0.4mm; HelpURL: \\cern.ch\dfs\Applications\Altium\Datasheets\R0402_Phycomp_RC0402.pdf; Author: CERN DEM JLC; CreateDate: 03.12.2007; LatestRevisionDate: 17.10.2012
R16 R19 = R0402_100K_1%_0.0625W_100PPM: Resistor - 1%; Part Description: General Purpose Thick Film Chip Resistor; Manufacturer: GENERIC; Manufacturer1 Part Number: 232270671004L; TC: ±100ppm/°C; PressFit: No; Part Number: R0402_100K_1%_0.0625W_100PPM; Component Kind: Standard; Component Type: Standard; Pin Count: 2; Value: 100k; Status: Not Recommended; Power: 0.0625W; Tolerance: ±1%; Manufacturer Part Number: R0402_100K_1%_0.0625W_100PPM; Case: 0402; Mounted: Yes; Sense: No; Socket: No; SMD: Yes; Manufacturer1 Example: YAGEO PHYCOMP; Manufacturer1 ComponentHeight: 0.4mm; HelpURL: \\cern.ch\dfs\Applications\Altium\Datasheets\R0402_Phycomp_RC0402.pdf; Author: CERN DEM JLC; CreateDate: 03.12.2007; LatestRevisionDate: 17.10.2012
R17 R21 = R0402_120K_1%_0.0625W_100PPM: Resistor - 1%; Part Description: General Purpose Thick Film Chip Resistor; Manufacturer: GENERIC; Manufacturer1 Part Number: 232270671204L; TC: ±100ppm/°C; PressFit: No; Part Number: R0402_120K_1%_0.0625W_100PPM; Component Kind: Standard; Component Type: Standard; Pin Count: 2; Value: 120k; Status: Not Recommended; Power: 0.0625W; Tolerance: ±1%; Manufacturer Part Number: R0402_120K_1%_0.0625W_100PPM; Case: 0402; Mounted: Yes; Sense: No; Socket: No; SMD: Yes; Manufacturer1 Example: YAGEO PHYCOMP; Manufacturer1 ComponentHeight: 0.4mm; HelpURL: \\cern.ch\dfs\Applications\Altium\Datasheets\R0402_Phycomp_RC0402.pdf; Author: CERN DEM JLC; CreateDate: 03.12.2007; LatestRevisionDate: 17.10.2012
R18 R31 R32 = R0402_150K_1%_0.0625W_100PPM: Resistor - 1%; Part Description: General Purpose Thick Film Chip Resistor; Manufacturer: GENERIC; Manufacturer1 Part Number: 232270671504L; TC: ±100ppm/°C; PressFit: No; Part Number: R0402_150K_1%_0.0625W_100PPM; Component Kind: Standard; Component Type: Standard; Pin Count: 2; Value: 150k; Status: Not Recommended; Power: 0.0625W; Tolerance: ±1%; Manufacturer Part Number: R0402_150K_1%_0.0625W_100PPM; Case: 0402; Mounted: Yes; Sense: No; Socket: No; SMD: Yes; Manufacturer1 Example: YAGEO PHYCOMP; Manufacturer1 ComponentHeight: 0.4mm; HelpURL: \\cern.ch\dfs\Applications\Altium\Datasheets\R0402_Phycomp_RC0402.pdf; Author: CERN DEM JLC; CreateDate: 03.12.2007; LatestRevisionDate: 17.10.2012
R20 R29 = R0402_470K_1%_0.0625W_100PPM: Resistor - 1%; Part Description: General Purpose Thick Film Chip Resistor; Manufacturer: GENERIC; Manufacturer1 Part Number: 232270674704L; TC: ±100ppm/°C; PressFit: No; Part Number: R0402_470K_1%_0.0625W_100PPM; Component Kind: Standard; Component Type: Standard; Pin Count: 2; Value: 470k; Status: Not Recommended; Power: 0.0625W; Tolerance: ±1%; Manufacturer Part Number: R0402_470K_1%_0.0625W_100PPM; Case: 0402; Mounted: Yes; Sense: No; Socket: No; SMD: Yes; Manufacturer1 Example: YAGEO PHYCOMP; Manufacturer1 ComponentHeight: 0.4mm; HelpURL: \\cern.ch\dfs\Applications\Altium\Datasheets\R0402_Phycomp_RC0402.pdf; Author: CERN DEM JLC; CreateDate: 03.12.2007; LatestRevisionDate: 17.10.2012
R23 = R0402_5K1_1%_0.0625W_100PPM: Resistor - 1%; Part Description: General Purpose Thick Film Chip Resistor; Manufacturer: GENERIC; Manufacturer1 Part Number: 232270675102L; TC: ±100ppm/°C; PressFit: No; Part Number: R0402_5K1_1%_0.0625W_100PPM; Component Kind: Standard; Component Type: Standard; Pin Count: 2; Value: 5k1; Status: Not Recommended; Power: 0.0625W; Tolerance: ±1%; Manufacturer Part Number: R0402_5K1_1%_0.0625W_100PPM; Case: 0402; Mounted: Yes; Sense: No; Socket: No; SMD: Yes; Manufacturer1 Example: YAGEO PHYCOMP; Manufacturer1 ComponentHeight: 0.4mm; HelpURL: \\cern.ch\dfs\Applications\Altium\Datasheets\R0402_Phycomp_RC0402.pdf; Author: CERN DEM JLC; CreateDate: 03.12.2007; LatestRevisionDate: 17.10.2012
R28 R30 = R0402_130K_1%_0.0625W_100PPM: Resistor - 1%; Part Description: General Purpose Thick Film Chip Resistor; Manufacturer: GENERIC; Manufacturer1 Part Number: 232270671304L; TC: ±100ppm/°C; PressFit: No; Part Number: R0402_130K_1%_0.0625W_100PPM; Component Kind: Standard; Component Type: Standard; Pin Count: 2; Value: 130k; Status: Not Recommended; Power: 0.0625W; Tolerance: ±1%; Manufacturer Part Number: R0402_130K_1%_0.0625W_100PPM; Case: 0402; Mounted: Yes; Sense: No; Socket: No; SMD: Yes; Manufacturer1 Example: YAGEO PHYCOMP; Manufacturer1 ComponentHeight: 0.4mm; HelpURL: \\cern.ch\dfs\Applications\Altium\Datasheets\R0402_Phycomp_RC0402.pdf; Author: CERN DEM JLC; CreateDate: 03.12.2007; LatestRevisionDate: 17.10.2012
R33 = R0402_27K_1%_0.0625W_100PPM: Resistor - 1%; Part Description: General Purpose Thick Film Chip Resistor; Manufacturer: GENERIC; Manufacturer1 Part Number: 232270672703L; TC: ±100ppm/°C; PressFit: No; Part Number: R0402_27K_1%_0.0625W_100PPM; Component Kind: Standard; Component Type: Standard; Pin Count: 2; Value: 27k; Status: Not Recommended; Power: 0.0625W; Tolerance: ±1%; Manufacturer Part Number: R0402_27K_1%_0.0625W_100PPM; Case: 0402; Mounted: Yes; Sense: No; Socket: No; SMD: Yes; Manufacturer1 Example: YAGEO PHYCOMP; Manufacturer1 ComponentHeight: 0.4mm; HelpURL: \\cern.ch\dfs\Applications\Altium\Datasheets\R0402_Phycomp_RC0402.pdf; Author: CERN DEM JLC; CreateDate: 03/12/2007; LatestRevisionDate: 17/10/2012
R34 = R0402_8K2_1%_0.0625W_100PPM: Resistor - 1%; Part Description: General Purpose Thick Film Chip Resistor; Manufacturer: GENERIC; Manufacturer1 Part Number: 232270678202L; TC: ±100ppm/°C; PressFit: No; Part Number: R0402_8K2_1%_0.0625W_100PPM; Component Kind: Standard; Component Type: Standard; Pin Count: 2; Value: 8k2; Status: Not Recommended; Power: 0.0625W; Tolerance: ±1%; Manufacturer Part Number: R0402_8K2_1%_0.0625W_100PPM; Case: 0402; Mounted: Yes; Sense: No; Socket: No; SMD: Yes; Manufacturer1 Example: YAGEO PHYCOMP; Manufacturer1 ComponentHeight: 0.4mm; HelpURL: \\cern.ch\dfs\Applications\Altium\Datasheets\R0402_Phycomp_RC0402.pdf; Author: CERN DEM JLC; CreateDate: 03.12.2007; LatestRevisionDate: 17.10.2012
R38 = R0402_0R_JUMPER: Resistor; Part Description: 1A (0.05R Max DC Resistance) Zero Ohm Jumper; Manufacturer: GENERIC; Manufacturer1 Part Number: 232270591001L; Part Number: R0402_0R_JUMPER; Component Kind: Standard; Component Type: Standard; Pin Count: 2; Value: 0; Status: Not recommended; Manufacturer Part Number: R0402_0R_JUMPER; Case: 0402; Mounted: Yes; Sense: No; Socket: No; SMD: Yes; Manufacturer1 Example: YAGEO PHYCOMP; Manufacturer1 ComponentHeight: 0.4mm; HelpURL: \\cern.ch\dfs\Applications\Altium\Datasheets\R0402_Phycomp_RC0402.pdf; Author: CERN DEM JLC; CreateDate: 03.12.2007; LatestRevisionDate: 17.10.2012
R39 = R0805_NO-VALUE: Resistor; Part Description: Reserved Footprint For a 0805 (2012) Chip Resistor; PressFit: No; Mounted: No; Part Number: R0805_NO-VALUE; Component Kind: Standard; Component Type: Standard; Pin Count: 2; Value: Undefined; Status: None; Manufacturer: Undefined; Manufacturer Part Number: R0805_NO-VALUE; Case: 0805; Sense: No; Socket: No; SMD: Yes; Manufacturer1 Example: Undefined; Manufacturer1 Part Number: Undefined; Manufacturer1 ComponentHeight: Undefined; HelpURL: Undefined; Author: CERN DEM JLC; CreateDate: 03.12.2007; LatestRevisionDate: 13.03.2008
R40 = R0603_1K3_1%_0.1W_100PPM: Resistor - 1%; Part Description: General Purpose Thick Film Chip Resistor; Manufacturer: GENERIC; Manufacturer1 Part Number: NRC06F1301TRF; Power: 0.1W; TC: ±100ppm/°C; PressFit: No; Part Number: R0603_1K3_1%_0.1W_100PPM; Component Kind: Standard; Component Type: Standard; Pin Count: 2; Value: 1k3; Status: Preferred; Tolerance: ±1%; Manufacturer Part Number: R0603_1K3_1%_0.1W_100PPM; Case: 0603; Mounted: Yes; Sense: No; Socket: No; SMD: Yes; Manufacturer1 Example: NIC COMPONENT; Manufacturer1 ComponentHeight: 0.55mm; HelpURL: \\cern.ch\dfs\Applications\Altium\Datasheets\R0603_NIC_NRC.pdf; Author: CERN DEM JLC; CreateDate: 03.12.2007; LatestRevisionDate: 13.03.2008
R42 R140 R184 = R0603_82K_1%_0.1W_100PPM: Resistor - 1%; Part Description: General Purpose Thick Film Chip Resistor; Manufacturer: GENERIC; Manufacturer1 Part Number: NRC06F8202TRF; Power: 0.1W; TC: ±100ppm/°C; Part Number: R0603_82K_1%_0.1W_100PPM; Component Kind: Standard; Component Type: Standard; Pin Count: 2; Value: 82k; Status: Preferred; Tolerance: ±1%; Manufacturer Part Number: R0603_82K_1%_0.1W_100PPM; Case: 0603; Mounted: Yes; Sense: No; Socket: No; SMD: Yes; Manufacturer1 Example: NIC COMPONENT; Manufacturer1 ComponentHeight: 0.55mm; HelpURL: \\cern.ch\dfs\Applications\Altium\Datasheets\R0603_NIC_NRC.pdf; Author: CERN DEM JLC; CreateDate: 03.12.2007; LatestRevisionDate: 13.03.2008
R43 = R0402_33K_1%_0.0625W_100PPM: Resistor - 1%; Part Description: General Purpose Thick Film Chip Resistor; Manufacturer: GENERIC; Manufacturer1 Part Number: 232270673303L; TC: ±100ppm/°C; PressFit: No; Part Number: R0402_33K_1%_0.0625W_100PPM; Component Kind: Standard; Component Type: Standard; Pin Count: 2; Value: 33k; Status: Not Recommended; Power: 0.0625W; Tolerance: ±1%; Manufacturer Part Number: R0402_33K_1%_0.0625W_100PPM; Case: 0402; Mounted: Yes; Sense: No; Socket: No; SMD: Yes; Manufacturer1 Example: YAGEO PHYCOMP; Manufacturer1 ComponentHeight: 0.4mm; HelpURL: \\cern.ch\dfs\Applications\Altium\Datasheets\R0402_Phycomp_RC0402.pdf; Author: CERN DEM JLC; CreateDate: 03.12.2007; LatestRevisionDate: 17.10.2012
R146 = R0402_20K_1%_0.0625W_100PPM: Resistor - 1%; Part Description: General Purpose Thick Film Chip Resistor; Manufacturer: GENERIC; Manufacturer1 Part Number: 232270672003L; TC: ±100ppm/°C; PressFit: No; Part Number: R0402_20K_1%_0.0625W_100PPM; Component Kind: Standard; Component Type: Standard; Pin Count: 2; Value: 20k; Status: Not Recommended; Power: 0.0625W; Tolerance: ±1%; Manufacturer Part Number: R0402_20K_1%_0.0625W_100PPM; Case: 0402; Mounted: Yes; Sense: No; Socket: No; SMD: Yes; Manufacturer1 Example: YAGEO PHYCOMP; Manufacturer1 ComponentHeight: 0.4mm; HelpURL: \\cern.ch\dfs\Applications\Altium\Datasheets\R0402_Phycomp_RC0402.pdf; Author: CERN DEM JLC; CreateDate: 03.12.2007; LatestRevisionDate: 17.10.2012
R166 = R0805_10R_1%_0.125W_200PPM: Resistor - 1%; Part Description: General Purpose Thick Film Chip Resistor; Manufacturer: GENERIC; Manufacturer1 Part Number: NRC10F10R0TRF; Power: 0.125W; TC: ±200ppm/°C; PressFit: No; Part Number: R0805_10R_1%_0.125W_200PPM; Component Kind: Standard; Component Type: Standard; Pin Count: 2; Value: 10; Status: Preferred; Tolerance: ±1%; Manufacturer Part Number: R0805_10R_1%_0.125W_200PPM; Case: 0805; Mounted: Yes; Sense: No; Socket: No; SMD: Yes; Manufacturer1 Example: NIC COMPONENT; Manufacturer1 ComponentHeight: 0.6mm; HelpURL: \\cern.ch\dfs\Applications\Altium\Datasheets\R0805_NIC_NRC.pdf; Author: CERN DEM JLC; CreateDate: 03.12.2007; LatestRevisionDate: 24.06.2009
R168 = R0603_220R_1%_0.1W_100PPM: Resistor - 1%; Part Description: General Purpose Thick Film Chip Resistor; Manufacturer: GENERIC; Manufacturer1 Part Number: NRC06F2200TRF; Power: 0.1W; TC: ±100ppm/°C; Part Number: R0603_220R_1%_0.1W_100PPM; Component Kind: Standard; Component Type: Standard; Pin Count: 2; Value: 220; Status: Preferred; Tolerance: ±1%; Manufacturer Part Number: R0603_220R_1%_0.1W_100PPM; Case: 0603; Mounted: Yes; Sense: No; Socket: No; SMD: Yes; Manufacturer1 Example: NIC COMPONENT; Manufacturer1 ComponentHeight: 0.55mm; HelpURL: \\cern.ch\dfs\Applications\Altium\Datasheets\R0603_NIC_NRC.pdf; Author: CERN DEM JLC; CreateDate: 03.12.2007; LatestRevisionDate: 13.03.2008
T7 = FDN86246: N-CHANNEL MOSFET WITH DIODE; Part Description: 150V 1.6A N-Channel Power Trench® MOSFET; Manufacturer: ON SEMICONDUCTOR; PressFit: No; Bonding: No; Part Number: FDN86246; Component Kind: Standard; Component Type: Standard; Device: FDN86246; PackageDescription: SOT, 0.95mm, pitch; 3 pin,1.30mm W X 2.92mm L X 1.12mm H body, IPC Medium Density; Manufacturer Part Number: FDN86246; Pin Count: 3; Case: SOT23-3; Mounted: Yes; Socket: No; SMD: Yes; Sense: No; ComponentHeight: 1.12mm; HelpURL: \\cern.ch\dfs\Applications\Altium\Datasheets\FDN86246.pdf; ComponentLink1URL: \\cern.ch\dfs\Applications\Altium\Datasheets\FDN86246_Package.pdf; ComponentLink1Description: Package Drawing; Author: CERN DEM BC; CreateDate: 10.10.2019; LatestRevisionDate: 10.10.2019
T8 = BSS138LT1G: N-CHANNEL MOSFET WITH DIODE; Part Description: 50V 200mA N-Channel Enhancement Mode Field-Effect Transistor; Manufacturer: ON SEMICONDUCTOR; PressFit: No; Bonding: No; Part Number: BSS138LT1G; Component Kind: Standard; Component Type: Standard; Device: BSS138LT1G; PackageDescription: SOT23 3-Leads, Pitch 0.95mm - Body 1.4x3mm, IPC Medium Density; Manufacturer Part Number: BSS138LT1G; Pin Count: 3; Case: SOT23-3; Mounted: Yes; Socket: No; SMD: Yes; Sense: No; ComponentHeight: 1.11mm; HelpURL: \\cern.ch\dfs\Applications\Altium\Datasheets\BSS138LT1G.pdf; Author: CERN DEM JLC; CreateDate: 23.03.2009; LatestRevisionDate: 23.03.2009
T10 T11 = BSH103: N-CHANNEL MOSFET WITH DIODE; Part Description: 30V 850mA N-Channel Enhancement Mode Field-Effect Transistor; Manufacturer: NEXPERIA; PressFit: No; Bonding: No; Part Number: BSH103; Component Kind: Standard; Component Type: Standard; Device: BSH103; PackageDescription: SOT23, 3 pin, Pitch 0.95mm - 1.3mm W X 2.9mm L X 1.1mm H, IPC Medium Density; Manufacturer Part Number: BSH103; Pin Count: 3; Case: SOT23-3; Mounted: Yes; Socket: No; SMD: Yes; Sense: No; ComponentHeight: 1.1mm; HelpURL: \\cern.ch\dfs\Applications\Altium\Datasheets\BSH103.pdf; Author: CERN DEM JLC; CreateDate: 16.03.2010; LatestRevisionDate: 20.06.2017; ClassName: Artix
T12 = SI4425DDY-T1-GE3: -30V -19.7A P-Channel MOSFET; Manufacturer: VISHAY SILICONIX; PressFit: No; Bonding: No; Part Number: SI4425DDY-T1-GE3; Component Kind: Standard; Component Type: Standard; Device: SI4425DDY-T1-GE3; PackageDescription: SOIC 8, Pitch 1.27mm - Body 4x5mm, IPC Medium Density; Part Description: -30V -19.7A P-Channel MOSFET; Manufacturer Part Number: SI4425DDY-T1-GE3; Pin Count: 8; Case: SOIC8; Mounted: Yes; Socket: No; SMD: Yes; Sense: No; ComponentHeight: 1.75mm; HelpURL: \\cern.ch\dfs\Applications\Altium\Datasheets\SI4425DDY-T1-GE3.pdf; Author: CERN DEM MR; CreateDate: 05/10/2016; LatestRevisionDate: 05/10/2016
T13 = BC857BV: 45V, 100mA PNP General Purpose Double Transistor; Part Description: -45V -100mA PNP General Purpose Double Transistor; Manufacturer: NXP SEMICONDUCTORS; PressFit: No; Bonding: No; Part Number: BC857BV; Component Kind: Standard; Component Type: Standard; Device: BC857BV; PackageDescription: SOTFL (SOT666), 0.50mm, Pitch; 6 Pin, 1.20mm W X 1.60mm L X 0.60mm H Body, IPC Medium Density; Manufacturer Part Number: BC857BV; Pin Count: 6; Case: SOT666; Mounted: Yes; Socket: No; SMD: Yes; Sense: No; ComponentHeight: 0.6mm; HelpURL: \\cern.ch\dfs\Applications\Altium\Datasheets\BC857BV.pdf; Author: CERN DEM JLC; CreateDate: 01/12/2011; LatestRevisionDate: 01/12/2011
TP10-TP15 = SMD_PAD_1.27X1.27MM: Part Description: 1.27mm x 1.27mm PCB Copper Area (SMD Test Point); Mounted: No; Part Number: SMD_PAD_1.27X1.27MM; Component Kind: Standard (No BOM); Component Type: Standard (No BOM); Pin Count: 1; Family: Test Point; Socket: No; SMD: Yes; Sense: No; Status: None; ComponentHeight: 0mm; HelpURL: Undefined; Author: CERN DEM JLC; CreateDate: 12.01.2008; LatestRevisionDate: 12.01.2008; PackageDescription: 1.27mm x 1.27mm PCB Copper Area (SMD Test Point)